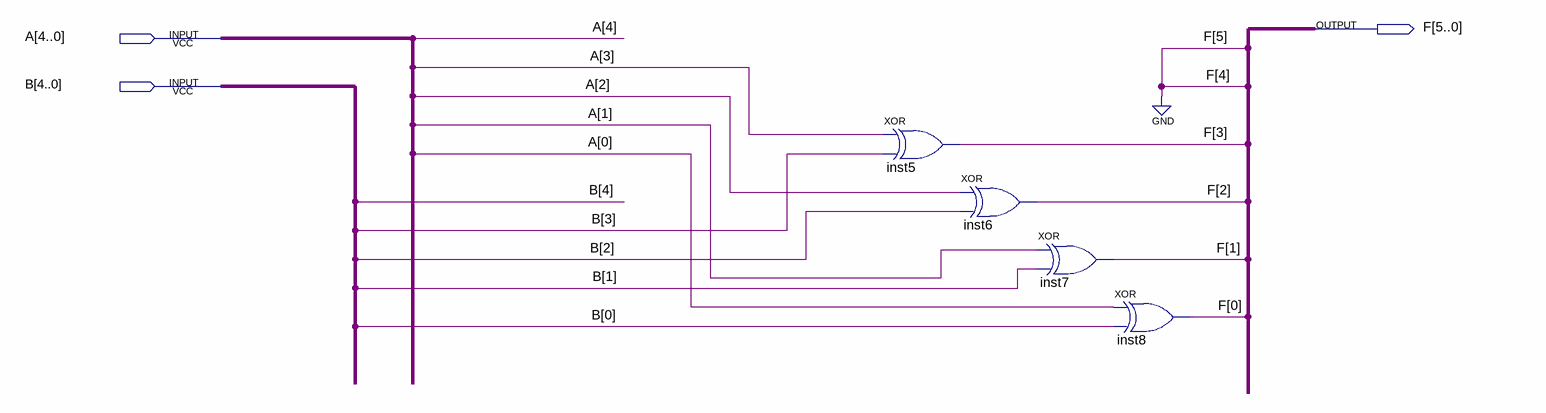
[diagram p0: schematic sheet]
// Quartus schematic eclb_XOR.bdf as structural Verilog: 4 symbols, 3 pins
module eclb_XOR (
  input  [4:0] A,
  input  [4:0] B,
  output [5:0] F
);

  xor inst5 (F[3], A[3], B[3]);
  xor inst6 (F[2], A[2], B[2]);
  xor inst7 (F[1], A[1], B[1]);
  xor inst8 (F[0], A[0], B[0]);

  assign F[5:4] = 2'b00;
endmodule
